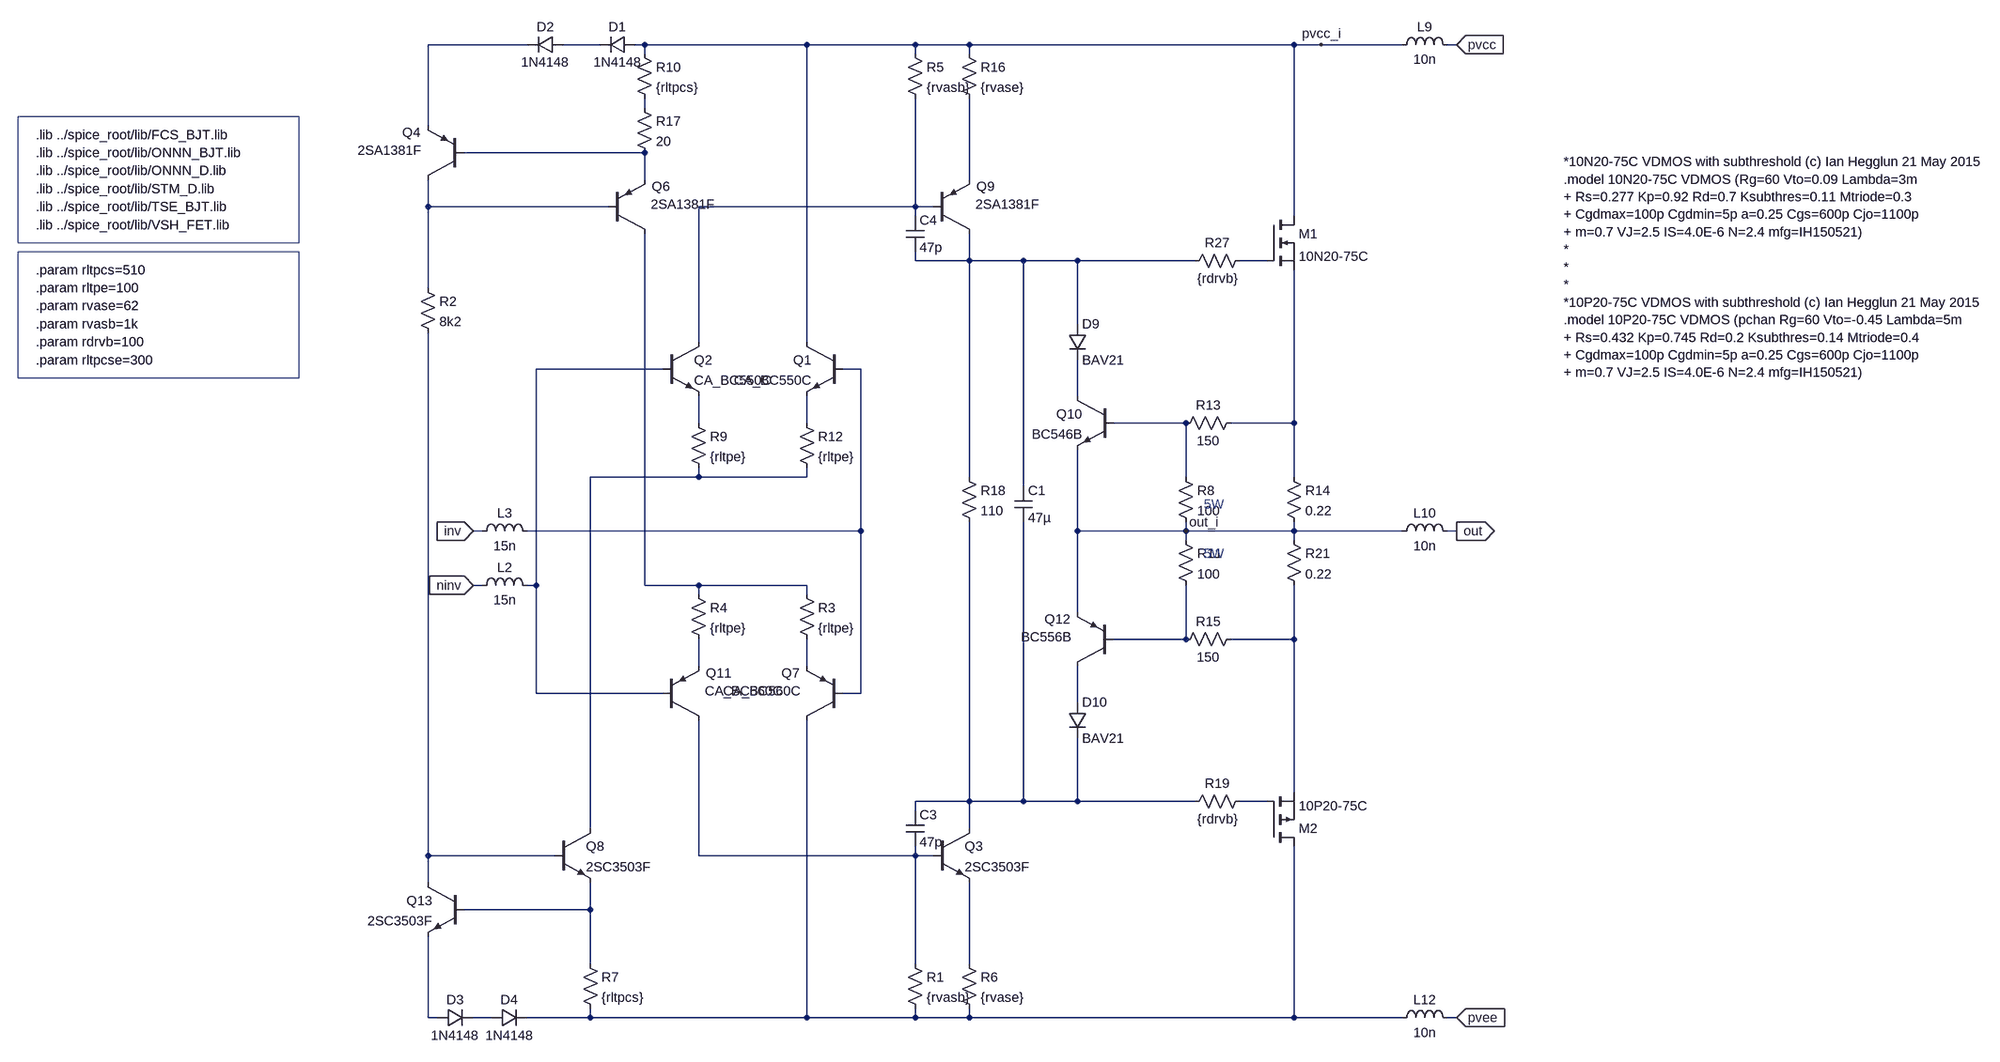
[diagram p0: schematic pab3bbb-compact-module-v1.asc]
pab3bbb-compact-module-v1.asc, the LTspice schematic file:
Version 4
SHEET 1 6124 2336
WIRE -16 -1088 -192 -1088
WIRE 112 -1088 48 -1088
WIRE 192 -1088 176 -1088
WIRE 480 -1088 192 -1088
WIRE 672 -1088 480 -1088
WIRE 768 -1088 672 -1088
WIRE 1344 -1088 768 -1088
WIRE 1392 -1088 1344 -1088
WIRE 1536 -1088 1392 -1088
WIRE 1632 -1088 1616 -1088
WIRE 192 -1072 192 -1088
WIRE 672 -1072 672 -1088
WIRE 768 -1072 768 -1088
WIRE 192 -976 192 -992
WIRE -192 -944 -192 -1088
WIRE 192 -896 -128 -896
WIRE 192 -848 192 -896
WIRE 768 -848 768 -992
WIRE -192 -800 -192 -848
WIRE 128 -800 -192 -800
WIRE 672 -800 672 -992
WIRE 672 -800 288 -800
WIRE 704 -800 672 -800
WIRE 672 -784 672 -800
WIRE 1344 -784 1344 -1088
WIRE 672 -704 672 -720
WIRE 768 -704 768 -752
WIRE 768 -704 672 -704
WIRE 864 -704 768 -704
WIRE 960 -704 864 -704
WIRE 1168 -704 960 -704
WIRE 1296 -704 1248 -704
WIRE -192 -656 -192 -800
WIRE 960 -592 960 -704
WIRE 288 -560 288 -800
WIRE 480 -560 480 -1088
WIRE 224 -512 0 -512
WIRE 576 -512 544 -512
WIRE 960 -464 960 -528
WIRE 288 -416 288 -464
WIRE 480 -416 480 -464
WIRE 1152 -416 1024 -416
WIRE 1344 -416 1344 -688
WIRE 1344 -416 1232 -416
WIRE 288 -320 288 -336
WIRE 288 -320 96 -320
WIRE 480 -320 480 -336
WIRE 480 -320 288 -320
WIRE 768 -320 768 -704
WIRE 1152 -320 1152 -416
WIRE 1344 -320 1344 -416
WIRE 864 -304 864 -704
WIRE -96 -224 -112 -224
WIRE 576 -224 576 -512
WIRE 576 -224 -16 -224
WIRE 960 -224 960 -368
WIRE 1152 -224 1152 -240
WIRE 1152 -224 960 -224
WIRE 1344 -224 1344 -240
WIRE 1344 -224 1152 -224
WIRE 1536 -224 1344 -224
WIRE 1632 -224 1616 -224
WIRE 1152 -208 1152 -224
WIRE 1344 -208 1344 -224
WIRE -96 -128 -112 -128
WIRE 0 -128 0 -512
WIRE 0 -128 -16 -128
WIRE 192 -128 192 -752
WIRE 288 -128 192 -128
WIRE 480 -128 288 -128
WIRE 288 -112 288 -128
WIRE 480 -112 480 -128
WIRE 960 -80 960 -224
WIRE 1152 -32 1152 -128
WIRE 1152 -32 1024 -32
WIRE 1344 -32 1344 -128
WIRE 1344 -32 1232 -32
WIRE 288 16 288 -32
WIRE 480 16 480 -32
WIRE 0 64 0 -128
WIRE 224 64 0 64
WIRE 576 64 576 -224
WIRE 576 64 544 64
WIRE 960 80 960 16
WIRE 1344 240 1344 -32
WIRE 768 256 768 -240
WIRE 768 256 672 256
WIRE 864 256 864 -240
WIRE 864 256 768 256
WIRE 960 256 960 144
WIRE 960 256 864 256
WIRE 1168 256 960 256
WIRE 1296 256 1248 256
WIRE 672 272 672 256
WIRE 96 304 96 -320
WIRE 768 304 768 256
WIRE -192 352 -192 -576
WIRE 32 352 -192 352
WIRE 288 352 288 112
WIRE 672 352 672 336
WIRE 672 352 288 352
WIRE 704 352 672 352
WIRE -192 400 -192 352
WIRE 96 448 96 400
WIRE 96 448 -128 448
WIRE 96 544 96 448
WIRE 672 544 672 352
WIRE 768 544 768 400
WIRE -192 640 -192 496
WIRE -176 640 -192 640
WIRE -80 640 -112 640
WIRE 96 640 96 624
WIRE 96 640 -16 640
WIRE 480 640 480 112
WIRE 480 640 96 640
WIRE 672 640 672 624
WIRE 672 640 480 640
WIRE 768 640 768 624
WIRE 768 640 672 640
WIRE 1344 640 1344 336
WIRE 1344 640 768 640
WIRE 1536 640 1344 640
WIRE 1632 640 1616 640
FLAG 1632 -1088 pvcc
IOPIN 1632 -1088 In
FLAG 1632 640 pvee
IOPIN 1632 640 In
FLAG 1632 -224 out
IOPIN 1632 -224 Out
FLAG -112 -128 ninv
IOPIN -112 -128 In
FLAG -112 -224 inv
IOPIN -112 -224 In
FLAG 1392 -1088 pvcc_i
FLAG 1152 -224 out_i
SYMBOL pnp 224 112 M180
WINDOW 0 77 84 Left 2
WINDOW 3 75 52 Left 2
SYMATTR InstName Q11
SYMATTR Value CA_BC560C
SYMBOL res 752 -1088 R0
SYMATTR InstName R16
SYMATTR Value {rvase}
SYMBOL res 1264 -720 R90
WINDOW 0 0 56 VBottom 2
WINDOW 3 32 56 VTop 2
SYMATTR InstName R27
SYMATTR Value {rdrvb}
SYMBOL npn 704 304 R0
SYMATTR InstName Q3
SYMATTR Value 2SC3503F
SYMBOL res 752 528 R0
SYMATTR InstName R6
SYMATTR Value {rvase}
SYMBOL pnp 544 112 R180
WINDOW 0 77 84 Left 2
WINDOW 3 75 52 Left 2
SYMATTR InstName Q7
SYMATTR Value CA_BC560C
SYMBOL res 1328 -336 R0
SYMATTR InstName R14
SYMATTR Value 0.22
SYMBOL res 1328 -224 R0
SYMATTR InstName R21
SYMATTR Value 0.22
SYMBOL ind -112 -112 R270
WINDOW 0 32 56 VTop 2
WINDOW 3 5 56 VBottom 2
SYMATTR InstName L2
SYMATTR Value 15n
SYMATTR SpiceLine Rser=20m
SYMBOL ind -112 -208 R270
WINDOW 0 32 56 VTop 2
WINDOW 3 5 56 VBottom 2
SYMATTR InstName L3
SYMATTR Value 15n
SYMATTR SpiceLine Rser=20m
SYMBOL ind 1520 -208 R270
WINDOW 0 32 56 VTop 2
WINDOW 3 5 56 VBottom 2
SYMATTR InstName L10
SYMATTR Value 10n
SYMATTR SpiceLine Rser=10m
SYMBOL ind 1520 -1072 R270
WINDOW 0 32 56 VTop 2
WINDOW 3 5 56 VBottom 2
SYMATTR InstName L9
SYMATTR Value 10n
SYMATTR SpiceLine Rser=10m
SYMBOL ind 1520 656 R270
WINDOW 0 32 56 VTop 2
WINDOW 3 5 56 VBottom 2
SYMATTR InstName L12
SYMATTR Value 10n
SYMATTR SpiceLine Rser=10m
SYMBOL res 1264 240 R90
WINDOW 0 0 56 VBottom 2
WINDOW 3 32 56 VTop 2
SYMATTR InstName R19
SYMATTR Value {rdrvb}
SYMBOL nmos 1296 -784 R0
SYMATTR InstName M1
SYMATTR Value 10N20-75C
SYMBOL pmos 1296 336 M180
SYMATTR InstName M2
SYMATTR Value 10P20-75C
SYMBOL pnp 704 -752 M180
WINDOW 0 77 84 Left 2
WINDOW 3 75 52 Left 2
SYMATTR InstName Q9
SYMATTR Value 2SA1381F
SYMBOL diode 944 -592 R0
SYMATTR InstName D9
SYMATTR Value BAV21
SYMBOL diode 944 80 R0
SYMATTR InstName D10
SYMATTR Value BAV21
SYMBOL res 656 528 R0
SYMATTR InstName R1
SYMATTR Value {rvasb}
SYMBOL res 656 -1088 R0
SYMATTR InstName R5
SYMATTR Value {rvasb}
SYMBOL cap 848 -304 R0
SYMATTR InstName C1
SYMATTR Value 47µ
SYMBOL res 272 -128 R0
SYMATTR InstName R4
SYMATTR Value {rltpe}
SYMBOL cap 656 272 R0
SYMATTR InstName C3
SYMATTR Value 47p
SYMBOL cap 656 -784 R0
SYMATTR InstName C4
SYMATTR Value 47p
SYMBOL res 464 -128 R0
SYMATTR InstName R3
SYMATTR Value {rltpe}
SYMBOL pnp 128 -752 M180
WINDOW 0 77 84 Left 2
WINDOW 3 75 52 Left 2
SYMATTR InstName Q6
SYMATTR Value 2SA1381F
SYMBOL npn 544 -560 M0
SYMATTR InstName Q1
SYMATTR Value CA_BC550C
SYMBOL npn 224 -560 R0
SYMATTR InstName Q2
SYMATTR Value CA_BC550C
SYMBOL npn 32 304 R0
SYMATTR InstName Q8
SYMATTR Value 2SC3503F
SYMBOL res 272 -432 R0
SYMATTR InstName R9
SYMATTR Value {rltpe}
SYMBOL res 464 -432 R0
SYMATTR InstName R12
SYMATTR Value {rltpe}
SYMBOL npn 1024 -464 M0
SYMATTR InstName Q10
SYMATTR Value BC546B
SYMBOL pnp 1024 16 R180
WINDOW 0 77 84 Left 2
WINDOW 3 75 52 Left 2
SYMATTR InstName Q12
SYMATTR Value BC556B
SYMBOL res 1136 -336 R0
SYMATTR InstName R8
SYMATTR Value 100
SYMBOL res 1136 -224 R0
SYMATTR InstName R11
SYMATTR Value 100
SYMBOL res 1248 -432 R90
WINDOW 0 0 56 VBottom 2
WINDOW 3 32 56 VTop 2
SYMATTR InstName R13
SYMATTR Value 150
SYMBOL res 1248 -48 R90
WINDOW 0 0 56 VBottom 2
WINDOW 3 32 56 VTop 2
SYMATTR InstName R15
SYMATTR Value 150
SYMBOL res 176 -1088 R0
SYMATTR InstName R10
SYMATTR Value {rltpcs}
SYMBOL pnp -128 -848 R180
WINDOW 0 77 84 Left 2
WINDOW 3 75 52 Left 2
SYMATTR InstName Q4
SYMATTR Value 2SA1381F
SYMBOL npn -128 400 M0
SYMATTR InstName Q13
SYMATTR Value 2SC3503F
SYMBOL res 80 528 R0
SYMATTR InstName R7
SYMATTR Value {rltpcs}
SYMBOL res -208 -672 R0
SYMATTR InstName R2
SYMATTR Value 8k2
SYMBOL res 176 -992 R0
SYMATTR InstName R17
SYMATTR Value 20
SYMBOL diode 176 -1104 R90
WINDOW 0 0 32 VBottom 2
WINDOW 3 32 32 VTop 2
SYMATTR InstName D1
SYMATTR Value 1N4148
SYMBOL diode 48 -1104 R90
WINDOW 0 0 32 VBottom 2
WINDOW 3 32 32 VTop 2
SYMATTR InstName D2
SYMATTR Value 1N4148
SYMBOL diode -176 656 R270
WINDOW 0 32 32 VTop 2
WINDOW 3 0 32 VBottom 2
SYMATTR InstName D3
SYMATTR Value 1N4148
SYMBOL diode -80 656 R270
WINDOW 0 32 32 VTop 2
WINDOW 3 0 32 VBottom 2
SYMATTR InstName D4
SYMATTR Value 1N4148
SYMBOL res 752 -336 R0
SYMATTR InstName R18
SYMATTR Value 110
TEXT -1344 -656 Left 2 !.param rltpe=100
TEXT 1184 -272 Left 2 ;5W
TEXT 1184 -184 Left 2 ;5W
TEXT -1344 -896 Left 2 !.lib ../spice_root/lib/ONNN_BJT.lib
TEXT -1344 -832 Left 2 !.lib ../spice_root/lib/STM_D.lib
TEXT -1344 -928 Left 2 !.lib ../spice_root/lib/FCS_BJT.lib
TEXT -1344 -864 Left 2 !.lib ../spice_root/lib/ONNN_D.lib
TEXT -1344 -800 Left 2 !.lib ../spice_root/lib/TSE_BJT.lib
TEXT -1344 -560 Left 2 !.param rdrvb=100
TEXT -1344 -768 Left 2 !.lib ../spice_root/lib/VSH_FET.lib
TEXT -1344 -688 Left 2 !.param rltpcs=510
TEXT -1344 -624 Left 2 !.param rvase=62
TEXT -1344 -592 Left 2 !.param rvasb=1k
TEXT -1344 -528 Left 2 !.param rltpcse=300
TEXT 2416 -880 Left 2 !*10N20-75C VDMOS with subthreshold (c) Ian Hegglun 21 May 2015\n.model 10N20-75C VDMOS (Rg=60 Vto=0.09 Lambda=3m \n+ Rs=0.277 Kp=0.92 Rd=0.7 Ksubthres=0.11 Mtriode=0.3  \n+ Cgdmax=100p Cgdmin=5p a=0.25 Cgs=600p Cjo=1100p  \n+ m=0.7 VJ=2.5 IS=4.0E-6 N=2.4 mfg=IH150521)\n*\n*\n*\n*10P20-75C VDMOS with subthreshold (c) Ian Hegglun 21 May 2015\n.model 10P20-75C VDMOS (pchan Rg=60 Vto=-0.45 Lambda=5m \n+ Rs=0.432 Kp=0.745 Rd=0.2 Ksubthres=0.14 Mtriode=0.4   \n+ Cgdmax=100p Cgdmin=5p a=0.25 Cgs=600p Cjo=1100p  \n+ m=0.7 VJ=2.5 IS=4.0E-6 N=2.4 mfg=IH150521)
RECTANGLE Normal -544 -736 -1376 -960
RECTANGLE Normal -544 -496 -1376 -720

The netlist it stands for:
* pab3bbb-compact-module-v1.asc
Q11 N027 N010 N021 0 CA_BC560C
R16 pvcc_i N005 {rvase}
R27 N009 N008 {rdrvb}
Q3 N024 N027 N029 0 2SC3503F
R6 N029 N032 {rvase}
Q7 N032 N011 N022 0 CA_BC560C
R14 N016 out_i 0.22
R21 out_i N020 0.22
L2 ninv N010 15n Rser=20m
L3 inv N011 15n Rser=20m
L10 out_i out 10n Rser=10m
L9 pvcc_i pvcc 10n Rser=10m
L12 N032 pvee 10n Rser=10m
R19 N025 N024 {rdrvb}
M1 pvcc_i N009 N016 N016 10N20-75C
M2 N032 N025 N020 N020 10P20-75C
Q9 N008 N007 N005 0 2SA1381F
D9 N008 N012 BAV21
D10 N023 N024 BAV21
R1 N027 N032 {rvasb}
R5 pvcc_i N007 {rvasb}
C1 N008 N024 47µ
R4 N018 N021 {rltpe}
C3 N024 N027 47p
C4 N007 N008 47p
R3 N018 N022 {rltpe}
Q6 N018 N006 N004 0 2SA1381F
Q1 pvcc_i N011 N014 0 CA_BC550C
Q2 N007 N010 N013 0 CA_BC550C
Q8 N017 N026 N028 0 2SC3503F
R9 N013 N017 {rltpe}
R12 N014 N017 {rltpe}
Q10 N012 N015 out_i 0 BC546B
Q12 N023 N019 out_i 0 BC556B
R8 N015 out_i 100
R11 out_i N019 100
R13 N016 N015 150
R15 N020 N019 150
R10 pvcc_i N003 {rltpcs}
Q4 N006 N004 N001 0 2SA1381F
Q13 N026 N028 N030 0 2SC3503F
R7 N028 N032 {rltpcs}
R2 N006 N026 8k2
R17 N003 N004 20
D1 pvcc_i N002 1N4148
D2 N002 N001 1N4148
D3 N030 N031 1N4148
D4 N031 N032 1N4148
R18 N008 N024 110
.model D D
.lib standard.dio
.model NPN NPN
.model PNP PNP
.lib standard.bjt
.model NMOS NMOS
.model PMOS PMOS
.lib standard.mos
.param rltpe=100
* 5W
* 5W
.lib ../spice_root/lib/ONNN_BJT.lib
.lib ../spice_root/lib/STM_D.lib
.lib ../spice_root/lib/FCS_BJT.lib
.lib ../spice_root/lib/ONNN_D.lib
.lib ../spice_root/lib/TSE_BJT.lib
.param rdrvb=100
.lib ../spice_root/lib/VSH_FET.lib
.param rltpcs=510
.param rvase=62
.param rvasb=1k
.param rltpcse=300
*10N20-75C VDMOS with subthreshold (c) Ian Hegglun 21 May 2015
.model 10N20-75C VDMOS (Rg=60 Vto=0.09 Lambda=3m
+ Rs=0.277 Kp=0.92 Rd=0.7 Ksubthres=0.11 Mtriode=0.3
+ Cgdmax=100p Cgdmin=5p a=0.25 Cgs=600p Cjo=1100p
+ m=0.7 VJ=2.5 IS=4.0E-6 N=2.4 mfg=IH150521)
*
*
*
*10P20-75C VDMOS with subthreshold (c) Ian Hegglun 21 May 2015
.model 10P20-75C VDMOS (pchan Rg=60 Vto=-0.45 Lambda=5m
+ Rs=0.432 Kp=0.745 Rd=0.2 Ksubthres=0.14 Mtriode=0.4
+ Cgdmax=100p Cgdmin=5p a=0.25 Cgs=600p Cjo=1100p
+ m=0.7 VJ=2.5 IS=4.0E-6 N=2.4 mfg=IH150521)
.backanno
.end